# Altium schematic sheet 2228_Recepteur_PIC32.SchDoc
size A4; Author: Miguel Santos; Organization: ETML-ES; Address1: Avenue Recordon 1; Address2: 1004 Lausanne; Address3: Switzerland; Revision: B; SheetNumber: 2; SheetTotal: 3; Version: 1.0
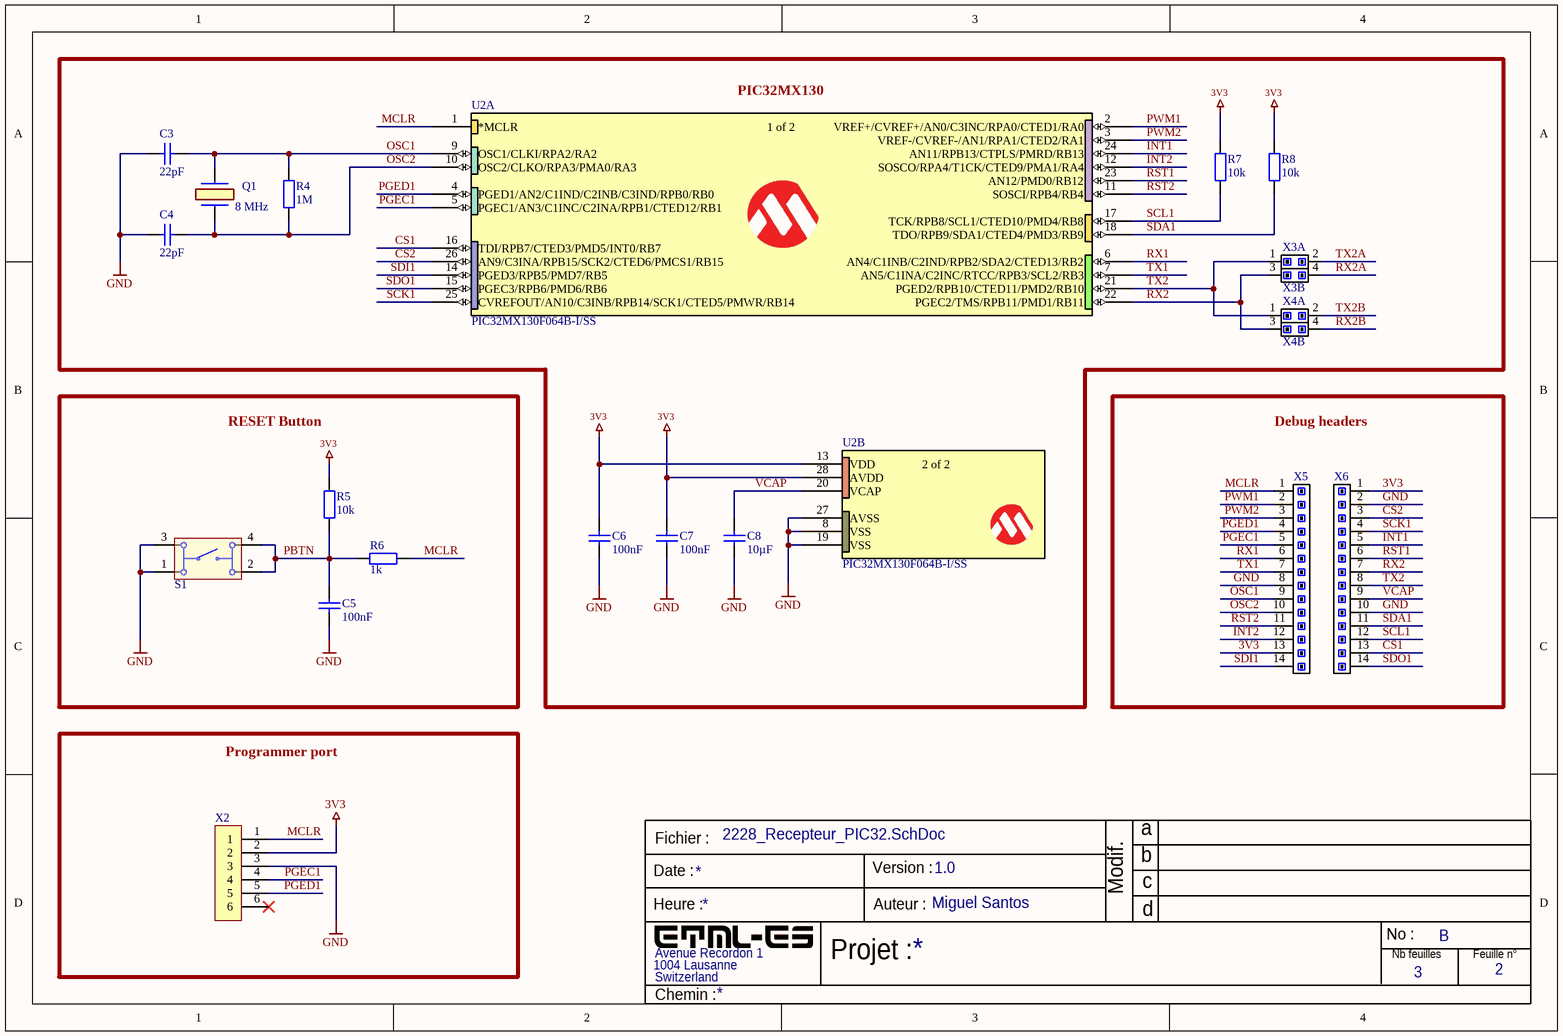
[diagram p0: 2228_Recepteur_PIC32.SchDoc]

## Parts
C3  value 22pF  [CAP_0805]  (hidden comment: CAP_SMD)
C4  value 22pF  [CAP_0805]  (hidden comment: CAP_SMD)
C5  value 100nF  [CAP_0805]  (hidden comment: CAP_SMD)
C6  value 100nF  [CAP_0805]  (hidden comment: CAP_SMD)
C7  value 100nF  [CAP_0805]  (hidden comment: CAP_SMD)
C8  value 10µF  [CAP_0805]  (hidden comment: CAP_SMD)
Q1  8 MHz  [LFXTAL003151]
R4  value 1M  [RES_0805]  (hidden comment: RES_SMD)
R5  value 10k  [RES_0805]  (hidden comment: RES_SMD)
R6  value 1k  [RES_0805]  (hidden comment: RES_SMD)
R7  value 10k  [RES_0805]  (hidden comment: RES_SMD)
R8  value 10k  [RES_0805]  (hidden comment: RES_SMD)
S1  430182043816  [430182043816]  (value not drawn)
U2  PIC32MX130F064B-I/SS  [SSOP28_MC_MCH-M]  (parts A,B of 2)
X2  6 pins Header  [HEADER_6PINS]  (value not drawn)
X3  2X2PIN_HEADER  [2x2_HEADER]  (value not drawn)  (parts A,B of 2)
X4  2X2PIN_HEADER  [2x2_HEADER]  (value not drawn)  (parts A,B of 2)
X5  14PIN_HEADER  [HEADER_14PINS]  (value not drawn)
X6  14PIN_HEADER  [HEADER_14PINS]  (value not drawn)

## Blocks framed on the sheet
PIC32MX130: C3 C4 C6-C8 Q1 R4 R7 R8 U2 X3 X4
RESET Button: C5 R5 R6 S1
Debug headers: X5 X6
Programmer port: X2

## Nets
3V3: C6.1 C7.1 R5.2 R7.2 R8.2 U2.13(VDD) U2.28(AVDD) X2.2 X5.13 X6.1
GND: C3.2 C4.1 C5.2 C6.2 C7.2 C8.2 S1.1 S1.3 U2.8(VSS) U2.19(VSS) U2.27(AVSS) X2.3 X5.8 X6.2 X6.10
CS1: U2.16(TDI/RPB7/CTED3/PMD5/INT0/RB7) X6.13
CS2: U2.26(AN9/C3INA/RPB15/SCK2/CTED6/PMCS1/RB15) X6.3
INT1: U2.24(AN11/RPB13/CTPLS/PMRD/RB13) X6.5
INT2: U2.12(SOSCO/RPA4/T1CK/CTED9/PMA1/RA4) X5.12
MCLR: R6.1 U2.1(*MCLR) X2.1 X5.1
OSC1: C3.1 Q1.1 R4.2 U2.9(OSC1/CLKI/RPA2/RA2) X5.9
OSC2: C4.2 Q1.2 R4.1 U2.10(OSC2/CLKO/RPA3/PMA0/RA3) X5.10
PBTN: C5.1 R5.1 R6.2 S1.2 S1.4
PGEC1: U2.5(PGEC1/AN3/C1INC/C2INA/RPB1/CTED12/RB1) X2.4 X5.5
PGED1: U2.4(PGED1/AN2/C1IND/C2INB/C3IND/RPB0/RB0) X2.5 X5.4
PWM1: U2.2(VREF+/CVREF+/AN0/C3INC/RPA0/CTED1/RA0) X5.2
PWM2: U2.3(VREF-/CVREF-/AN1/RPA1/CTED2/RA1) X5.3
RST1: U2.23(AN12/PMD0/RB12) X6.6
RST2: U2.11(SOSCI/RPB4/RB4) X5.11
RX1: U2.6(AN4/C1INB/C2IND/RPB2/SDA2/CTED13/RB2) X5.6
RX2: U2.22(PGEC2/TMS/RPB11/PMD1/RB11) X3.3 X4.3 X6.7
RX2A: X3.4
RX2B: X4.4
SCK1: U2.25(CVREFOUT/AN10/C3INB/RPB14/SCK1/CTED5/PMWR/RB14) X6.4
SCL1: R7.1 U2.17(TCK/RPB8/SCL1/CTED10/PMD4/RB8) X6.12
SDA1: R8.1 U2.18(TDO/RPB9/SDA1/CTED4/PMD3/RB9) X6.11
SDI1: U2.14(PGED3/RPB5/PMD7/RB5) X5.14
SDO1: U2.15(PGEC3/RPB6/PMD6/RB6) X6.14
TX1: U2.7(AN5/C1INA/C2INC/RTCC/RPB3/SCL2/RB3) X5.7
TX2: U2.21(PGED2/RPB10/CTED11/PMD2/RB10) X3.1 X4.1 X6.8
TX2A: X3.2
TX2B: X4.2
VCAP: C8.1 U2.20(VCAP) X6.9

Not connected (* = marked no-connect by the designer): X2 6*

## Notes on the sheet
- Fichier :
- a
- Date :
- Heure :
- Version :
- Auteur :
- Modif.
- b
- c
- d
- Projet :
- No :
- Nb feuilles
- Feuille n°
- Chemin :
- (in symbol PIC32MX130F064B-I/SS, part A) 1 of 2
- (in symbol PIC32MX130F064B-I/SS, part B) 2 of 2

## Library data of the parts
C3-C8 = CAP_SMD: Ceramic capacitor; Manufacturer: *; Manufacturer_Number: *
Q1 = LFXTAL003151: IQD FREQUENCY PRODUCTS - LFXTAL003151REEL - CRYSTAL, 8MHZ, 16PF, 11.4 X 4.9MM; Geometry.Height: 4.3mm; Manufacturer_Name: IQD; Manufacturer_Part_Number: LFXTAL003151REEL; Mouser Part Number: 449-LFXTAL003151REEL; Mouser Price/Stock: https://www.mouser.co.uk/ProductDetail/IQD/LFXTAL003151Reel?qs=e4%2FAndAAwgKt40cosvhepA%3D%3D; Arrow Part Number: LFXTAL003151REEL; Arrow Price/Stock: https://www.arrow.com/en/products/lfxtal003151reel/iqd-frequency-products?region=europe; Datasheet Link: https://www.iqdfrequencyproducts.com/products/pn/LFXTAL003151Reel.pdf
S1 = CMP-1452-00013-1: WS-TASV SMD Tact Switch 6X6 mm; Manufacturer: Wuerth Elektronik; NoPins: 04; ComponentLink2Description: Datasheet; PackageReference: 430182043816; ComponentLink2URL: http://katalog.we-online.de/em/datasheet/4301x2.pdf; ComponentLink1URL: http://www.we-online.com; PartNumber: 430182043816; ComponentLink1Description: Manufacturer URL
U2 = PIC32MX130F064B-I/SS: Manufacturer: Microchip; Manufacturer_Part_Number: PIC32MX130F064B-I/SS
R4-R8 = RES_SMD: Manufacturer: *; Manufacturer_Number: *